# EAGLE design touch sensor3 (EAGLE 9.6.2)
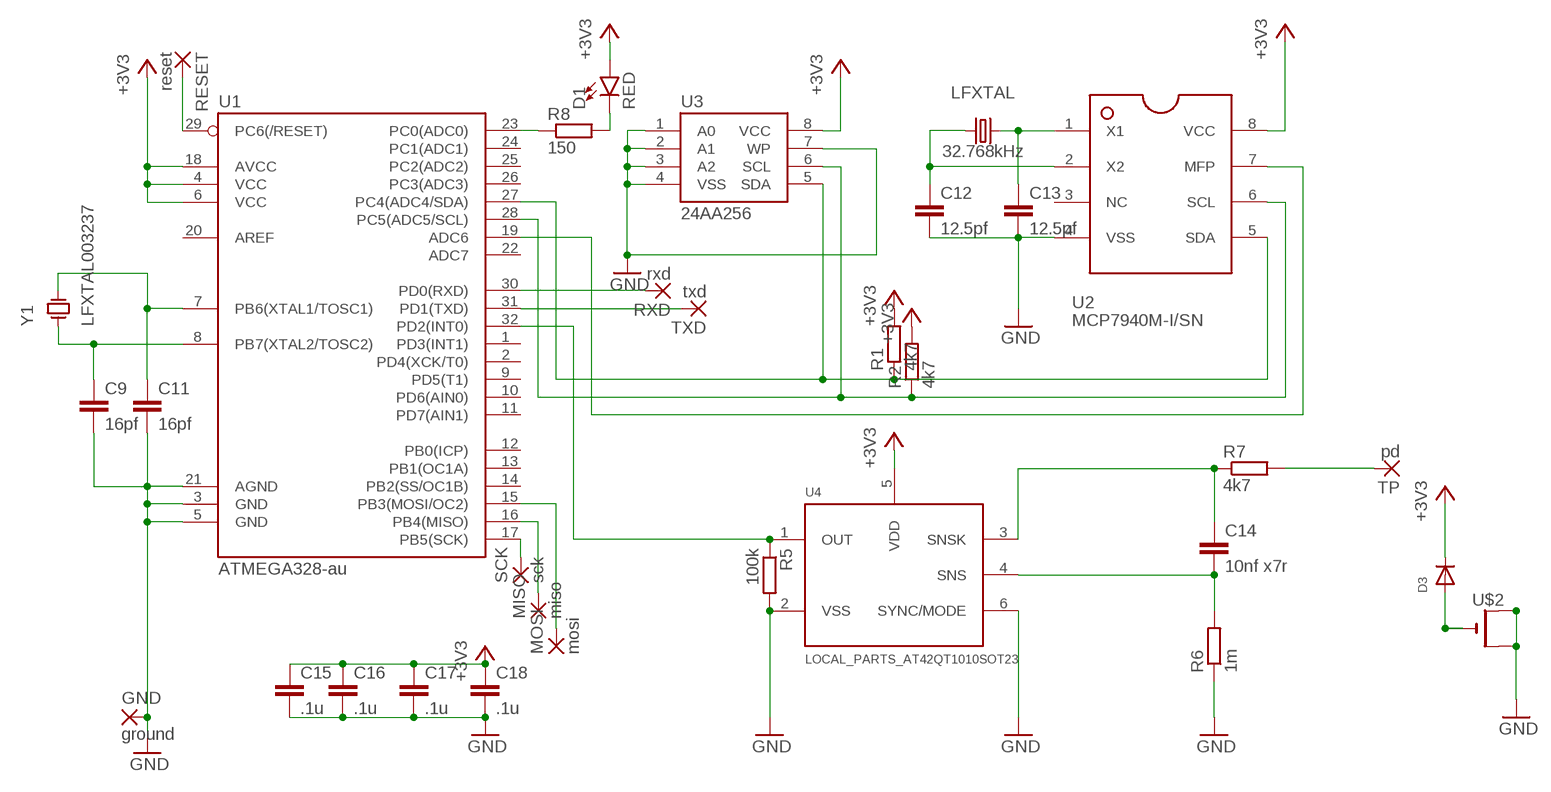
[diagram p0: schematic, sheet 1]

## Parts
C9  16pf  C-EUC0805  [C0805]
C11  16pf  C-EUC0805  [C0805]
C12  12.5pf  C-EUC0805  [C0805]
C13  12.5pf  C-EUC0805  [C0805]
C14  10nf x7r  C-EUC0805  [C0805]
C15  .1u  C-EUC0805  [C0805]
C16  .1u  C-EUC0805  [C0805]
C17  .1u  C-EUC0805  [C0805]
C18  .1u  C-EUC0805  [C0805]
D1  RED  LED-RED0603  [LED-0603]
D3  DIODESMA  [SMADIODE]
GND  ground  WIREPADSMD1,27-254  [SMD1,27-2,54]
LFXTAL  32.768kHz  CRYSTAL-32.768KHZPTH-2X6  [CRYSTAL-PTH-2X6-CYL]
MISO  miso  WIREPADSMD1,27-254  [SMD1,27-2,54]
MOSI  mosi  WIREPADSMD1,27-254  [SMD1,27-2,54]
R1  4k7  R-EU_M0805  [M0805]
R2  4k7  R-EU_M0805  [M0805]
R5  100k  R-EU_R0805  [R0805]
R6  1m  R-EU_R0805  [R0805]
R7  4k7  R-EU_R0805  [R0805]
R8  150  R-EU_R0805  [R0805]
RESET  reset  WIREPADSMD1,27-254  [SMD1,27-2,54]
RXD  rxd  WIREPADSMD1,27-254  [SMD1,27-2,54]
SCK  sck  WIREPADSMD1,27-254  [SMD1,27-2,54]
TP  pd  WIREPADSMD1,27-254  [SMD1,27-2,54]
TXD  txd  WIREPADSMD1,27-254  [SMD1,27-2,54]
U1  ATMEGA328-au  ATMEGA328P_TQFP  [TQFP32-08]
U2  MCP7940M-I/SN  [SO08]
U3  24AA256  EEPROM-I2CSMD  [SO08]
U4  LOCAL_PARTS_AT42QT1010SOT23  [LOCAL_PARTS_SOT23-6]
U$2  CR2032SMT  [CR2032-SMD]
Y1  LFXTAL003237  [XTAL1140X490X430N]

## Nets
+3V3: C15.1 C16.1 C17.1 C18.1 D1.A D3.C R1.2 R2.2 U1.4(VCC) U1.6(VCC) U1.18(AVCC) U2.8(VCC) U3.8(VCC) U4.5(VDD)
GND: C9.2 C11.2 C12.2 C13.2 C15.2 C16.2 C17.2 C18.2 GND.1(P) R5.2 R6.1 U1.3(GND) U1.5(GND) U1.21(AGND) U2.4(VSS) U3.1(A0) U3.2(A1) U3.3(A2) U3.4(VSS) U3.7(WP) U4.2(VSS) U4.6(SYNC/MODE) U$2.+$1(+) U$2.+$2(+1)
N$1: C13.1 LFXTAL.2 U2.1(X1)
N$2: C12.1 LFXTAL.1 U2.2(X2)
N$3: R1.1 U1.27(PC4(ADC4/SDA)) U2.5(SDA) U3.5(SDA)
N$4: R2.1 U1.28(PC5(ADC5/SCL)) U2.6(SCL) U3.6(SCL)
N$5: C11.1 U1.7(PB6(XTAL1/TOSC1)) Y1.2
N$6: R5.1 U1.32(PD2(INT0)) U4.1(OUT)
N$7: C9.1 U1.8(PB7(XTAL2/TOSC2)) Y1.1
N$8: R8.1 U1.23(PC0(ADC0))
N$9: D1.C R8.2
N$10: C14.2 R6.2 U4.4(SNS)
N$11: C14.1 R7.1 U4.3(SNSK)
N$12: R7.2 TP.1(P)
N$13: RESET.1(P) U1.29(PC6(/RESET))
N$14: U1.19(ADC6) U2.7(MFP)
N$16: RXD.1(P) U1.30(PD0(RXD))
N$17: TXD.1(P) U1.31(PD1(TXD))
N$18: SCK.1(P) U1.17(PB5(SCK))
N$19: MISO.1(P) U1.16(PB4(MISO))
N$20: MOSI.1(P) U1.15(PB3(MOSI/OC2))
VBAT: D3.A U$2.-
Unconnected: U1.1(PD3(INT1)) U1.2(PD4(XCK/T0)) U1.9(PD5(T1)) U1.10(PD6(AIN0)) U1.11(PD7(AIN1)) U1.12(PB0(ICP)) U1.13(PB1(OC1A)) U1.14(PB2(SS/OC1B)) U1.20(AREF) U1.22(ADC7) U1.24(PC1(ADC1)) U1.25(PC2(ADC2)) U1.26(PC3(ADC3)) U2.3(NC)

## Library data of the parts
C9 C11-C18 = rcl:C-EU: CAPACITOR, European symbol; SPICEPREFIX: C
D1 = SparkFun-LED:LED-RED: Red SMD LED Used in manufacturing of most products at SparkFun Packages: 0603 - SMD 0603 package [Product Link] <http://docs.avagotech.com/docs/AV02-0551EN> 0603 SMART - SMD 0603 SMART package ( more efficient and expensive)[Product Link] <http://www.osram-os.com/Graphics/XPic2/00077099_0.pdf> 1206 - SMD1206 package [Product Link] <https://www.sparkfun.com/datasheets/DevTools/LilyPad/Q150OVS4.pdff> SparkFun Products: Pro Mini 328 -5V <https://www.sparkfun.com/products/821> RedBoard <https://www.sparkfun.com/products/12757> IOIO-OTG <https://www.sparkfun.com/products/13613>; PROD_ID: DIO-00819
D3 = adafruit:DIODE: Diode SMADIODE - SMA Surface Mount Package 20V 1A Schottky Diode Digikey: 641-1014-6-ND DO-1N4148 - Through Hole Small Current Diode SOD-123 20V 1 A (.5mV Vf) Schottky Diode - Digikey: MBRX120TPMSCT-ND SOD-323 10V 570mA (.38mV Vf, 3ns) Schottky Diode - Digikey: ZLLS410CT-ND SOD-523 30V 30mA Schottky Diode (RB751S-40TE61) - Digikey: RB751S-40TE61CT-ND SOT23-R/W - SOT23 Package (R = Solder Paste/Reflow Ovens, W = Hand-Soldering) BAT54Film 40V 300mA - Digikey: 497-7162-1-ND
GND MISO MOSI RESET RXD SCK TP TXD = wirepad:WIREPAD: Wire PAD connect wire on PCB
LFXTAL = SparkFun-Clocks:CRYSTAL-32.768KHZ: 32.768kHz Crystal Frequency: 32.768kHz Frequency Stability: ±20ppm Load Capacitance: 12.5pF (PTH-2X6 & SMD-3.2X1.5), 6pF (SMD-2X6) SparkFun Products: SparkFun BigTime Watch Kit <https://www.sparkfun.com/products/11734> SparkFun nRF52832 Breakout <https://www.sparkfun.com/products/13990> SparkFun Real Time Clock Module <https://www.sparkfun.com/products/12708>; PROD_ID: XTAL-10112
R1 R2 R5-R8 = rcl:R-EU_: RESISTOR, European symbol; SPICEPREFIX: R
U1 = SparkFun-IC-Microcontroller:ATMEGA328P_TQFP: Popular 328P in QFP Storefront component: ATmega328 - TQFP <https://www.sparkfun.com/products/13448> (COM-13448) Datasheet <http://www.sparkfun.com/datasheets/Components/SMD/ATMega328.pdf> SparkFun Products SparkFun RedBoard - Programmed with Arduino <https://www.sparkfun.com/products/12757> (DEV-12757) Arduino Pro Mini 328 - 5V/16MHz <https://www.sparkfun.com/products/11113> (DEV-11113) Arduino Pro Mini 328 - 3.3V/8MHz <https://www.sparkfun.com/products/11114> (DEV-11114) SparkFun OpenLog <https://www.sparkfun.com/products/13712> (DEV-13712) SparkFun MicroView - OLED Arduino Module <https://www.sparkfun.com/products/12923> (DEV-12923) SparkFun Digital Sandbox <https://www.sparkfun.com/products/12651> (DEV-12651) SparkFun PicoBoard <https://www.sparkfun.com/products/11888> (WIG-11888) Arduino Fio <https://www.sparkfun.com/products/10116> (DEV-10116) LilyPad Arduino 328 Main Board <https://www.sparkfun.com/products/13342> (DEV-13342) SparkFun RedStick <https://www.sparkfun.com/products/13741> (DEV-13741) LilyPad MP3 <https://www.sparkfun.com/products/11013> (DEV-11013) LilyPad Arduino SimpleSnap <https://www.sparkfun.com/products/10941> (DEV-10941) SparkFun Stepoko <https://www.sparkfun.com/products/13899> (ROB-13899) SparkFun Geiger Counter <https://www.sparkfun.com/products/11345> (SEN-11345) SparkFun EL Sequencer <https://www.sparkfun.com/products/12781> (COM-12781) Arduino Pro 328 - 5V/16MHz <https://www.sparkfun.com/products/10915> (DEV-10915) CryptoCape <https://www.sparkfun.com/products/12773> (DEV-12773) SparkFun IR Thermometer Evaluation Board - MLX90614 <https://www.sparkfun.com/products/10740> (SEN-10740) SparkFun RedBot Mainboard <https://www.sparkfun.com/products/12097> (ROB-12097) Arduino Pro 328 - 3.3V/8MHz <https://www.sparkfun.com/products/10914> (DEV-10914) SparkFun Block for Intel® Edison - Arduino <https://www.sparkfun.com/products/13036> (DEV-13036) SparkFun Simon Says - Surface Mount Soldering Kit <https://www.sparkfun.com/products/10935> (KIT-10935) SparkFun 7-Segment Serial Display - Red <https://www.sparkfun.com/products/11441> (COM-11441) SparkFun 7-Segment Serial Display - White <https://www.sparkfun.com/products/11629> (COM-11629) SparkFun 7-Segment Serial Display - Yellow <https://www.sparkfun.com/products/11443> (COM-11443) SparkFun 7-Segment Serial Display - Kelly Green <https://www.sparkfun.com/products/11440> (COM-11440) SparkFun 7-Segment Serial Display - Blue <https://www.sparkfun.com/products/11442> (COM-11442) SparkFun OpenSegment Serial Display - 20mm (Blue) <https://www.sparkfun.com/products/11647> (COM-11647) SparkFun OpenSegment Serial Display - 20mm (Green) <https://www.sparkfun.com/products/11646> (COM-11646) SparkFun OpenSegment Serial Display - 20mm (White) <https://www.sparkfun.com/products/11648> (COM-11648) SparkFun OpenSegment Serial Display - 20mm (Red) <https://www.sparkfun.com/products/11644> (COM-11644) SparkFun OpenSegment Serial Display - 20mm (Yellow) <https://www.sparkfun.com/products/11645> (COM-11645) SparkFun OpenSegment Shield <https://www.sparkfun.com/products/13190> (DEV-13190); PROD_ID: IC-09069; VALUE: ATMEGA328P_TQFP
U2 = MCP7940M-I_SN:MCP7940M-I/SN: http://octopart.com/mcp7940m-i%2Fsn-microchip-21636090; AVAILABILITY: Unavailable; DESCRIPTION: Real Time Clock (RTC) IC Clock/Calendar 64B I²C, 2-Wire Serial 8-SOIC (0.154, 3.90mm Width); MF: Microchip; MP: MCP7940M-I/SN; PACKAGE: SOIC-8 Microchip; PRICE: None
U3 = SparkFun-IC-Memory:EEPROM-I2C: I2C EEPROMs, 24LC256 and others 24LC256 Series 256 kb I2C 2 Wire (32 k x 8 Bit) 2.5 V Serial EEPROM SMD - SOIC-8 Datasheet SparkFun Products SparkFun UDB5 - PIC UAV Development Board <https://www.sparkfun.com/products/11703> (GPS-11703); PROD_ID: IC-09714; VALUE: 24LC256
U4 = AT42QT101X_Capacitive_Touch_Breakout7:LOCAL_PARTS_AT42QT1010: Atmel AT42QT1010 The AT42QT1010 (QT1010) is a digital burst mode charge-transfer (QT™) sensor that is capable of detecting nearproximityor touch, making it ideal for implementing touch controls.The QT1010 is designed specifically for human interfaces, like control panels, appliances, toys, lighting controls, or anywhere a mechanical switch or button may be found. It includes all hardware and signal processing functions necessary to provide stable sensing under a wide variety of changing conditions. Only a single low-cost capacitor is required for operation. This chip is identical to the AT42QT1011, however the capsense times out after 60 seconds. Reciprocally, the capsense on the 1011 never times out. Reference "Signal Processing" in the datasheet. Datasheet <http://www.atmel.com/images/Atmel-9541-AT42-QTouch-BSW-AT42QT1010_Datasheet.pdf> Sparkfun Products Sparkfun Capacitive Touch Breakout <https://www.sparkfun.com/products/12041> (SEN-12041)
U$2 = adafruit:CR2032
Y1 = LFXTAL003237:LFXTAL003237: HC49/4HSMX Series 16.000 MHz ±30 ppm 16 pF Low Profile Surface Mount Crystal; AVAILABILITY: Unavailable; DESCRIPTION: 16MHz ±30ppm Crystal 16pF 40 Ohms HC-49/US; MF: IQD Frequency Products; MP: LFXTAL003237; PACKAGE: HC-49/US IQD Frequency Products; PRICE: None

## Board
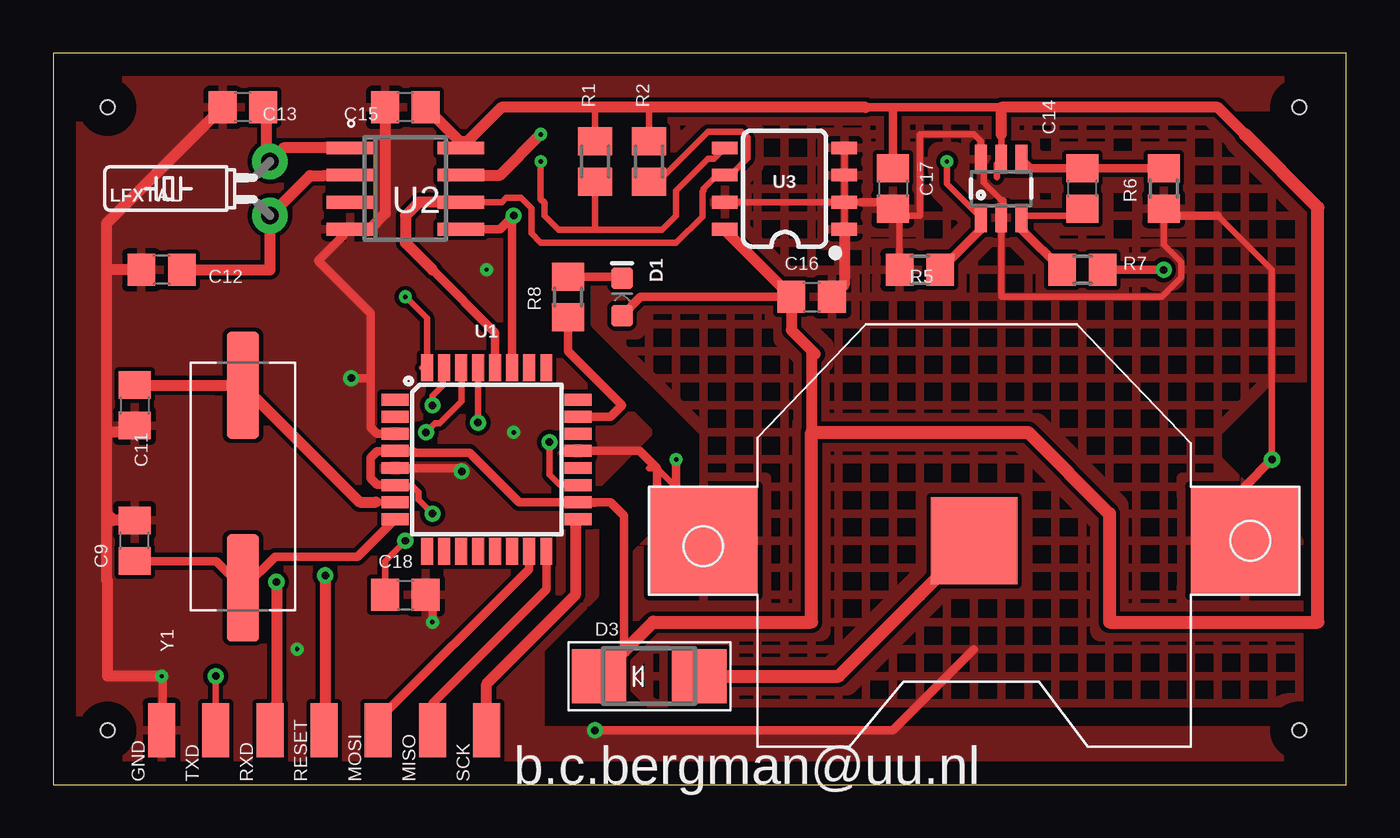
[diagram p1: board, top side]
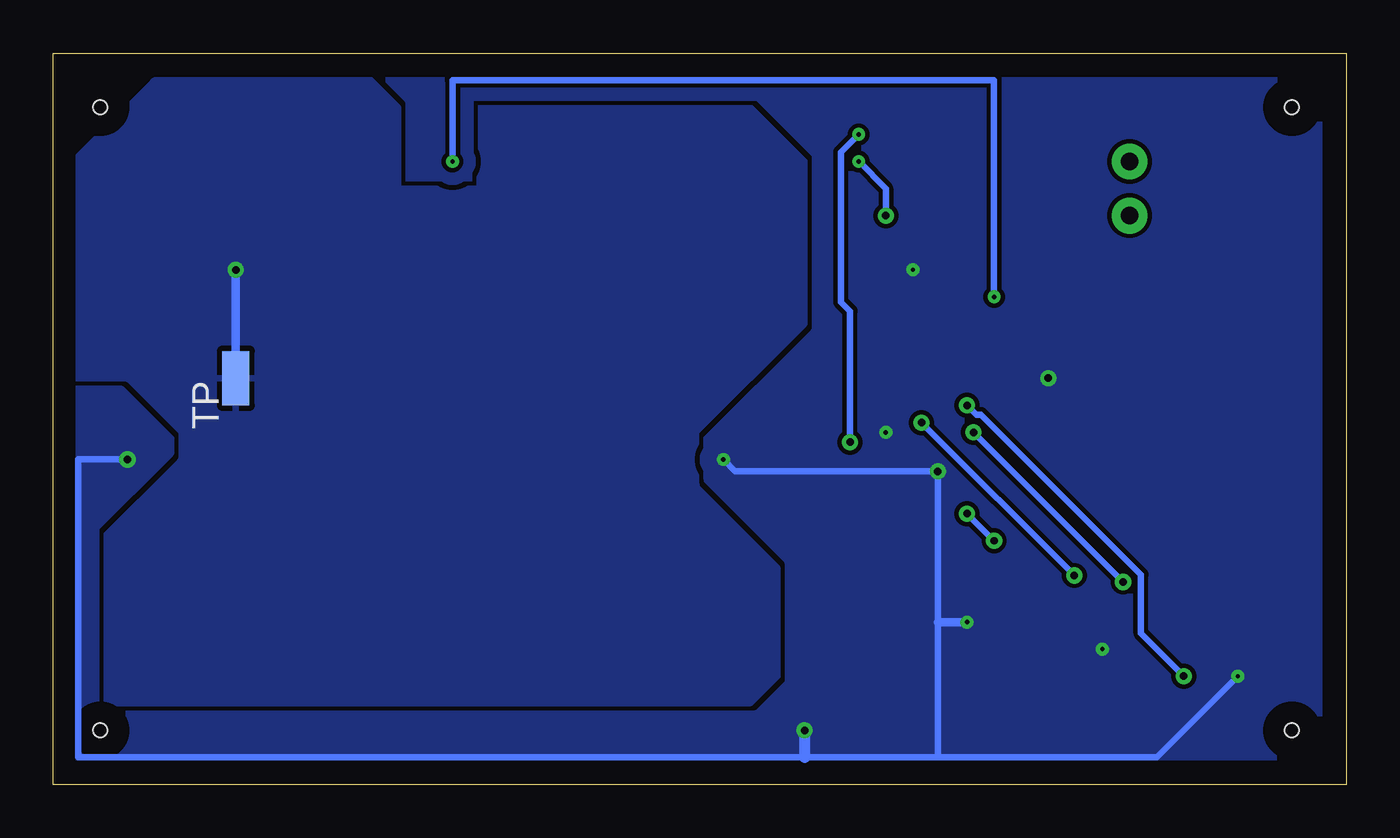
[diagram p2: board, bottom side, seen from below]

Size 60.63 x 34.28 mm. Coordinates in mm from the lower left corner, seen from the top.
Outline: 0,0 60.63,0 60.63,34.28 0,34.28 0,0
Copper layers (1*16): Top 0.035mm / dielectric 1.5mm / Bottom 0.035mm
Design rules "default *": minimum track width 12mil, minimum drill 0.2mm, track to track 8mil, track to pad 8mil, pad to pad 8mil, via to via 8mil, smd to smd 8mil, copper to edge 40mil, drill to drill 6mil, minimum pad ring 10mil, minimum via ring 8mil, stop-mask expansion 4mil, vias tented up to drill 0mil, thermal gap 10mil
Holes 0.65 mm at 2.54,31.75 2.54,2.54 58.42,2.54 58.42,31.75

### Footprints (pad centres in the part's own frame; a part is rotated, then mirrored left to right if it is on the bottom)
C0805 = smd 1.3 x 1.5: 1 -0.95,0; 2 0.95,0
LED-0603 = smd 1 x 1: A -0.877,0; C 0.877,0
SMADIODE = smd 2.54 x 2.54: A 2.349,0; C -2.349,0
SMD1,27-2,54 = smd 1.27 x 2.54: 1 0,0
CRYSTAL-PTH-2X6-CYL = drill 0.813 pad 1.676: 1 -1.27,0; 2 1.27,0
M0805 = smd 1.3 x 1.6: 1 -0.95,0; 2 0.95,0
R0805 = smd 1.3 x 1.5: 1 -0.95,0; 2 0.95,0
TQFP32-08 = smd 1.27 x 0.559: 1 -4.293,2.8; 2 -4.293,2; 3 -4.293,1.2; 4 -4.293,0.4; 5 -4.293,-0.4; 6 -4.293,-1.2; 7 -4.293,-2; 8 -4.293,-2.8; 17 4.293,-2.8; 18 4.293,-2; 19 4.293,-1.2; 20 4.293,-0.4; 21 4.293,0.4; 22 4.293,1.2; 23 4.293,2; 24 4.293,2.8 | smd 0.559 x 1.27: 9 -2.8,-4.293; 10 -2,-4.293; 11 -1.2,-4.293; 12 -0.4,-4.293; 13 0.4,-4.293; 14 1.2,-4.293; 15 2,-4.293; 16 2.8,-4.293; 25 2.8,4.293; 26 2,4.293; 27 1.2,4.293; 28 0.4,4.293; 29 -0.4,4.293; 30 -1.2,4.293; 31 -2,4.293; 32 -2.8,4.293
SO08 = smd 2.2 x 0.6: 1 -2.6,1.905; 2 -2.6,0.635; 3 -2.6,-0.635; 4 -2.6,-1.905; 5 2.6,-1.905; 6 2.6,-0.635; 7 2.6,0.635; 8 2.6,1.905
SO08' = smd 0.6 x 1.2: 1 -1.905,-2.8; 2 -0.635,-2.8; 3 0.635,-2.8; 4 1.905,-2.8; 5 1.905,2.8; 6 0.635,2.8; 7 -0.635,2.8; 8 -1.905,2.8
LOCAL_PARTS_SOT23-6 = smd 0.55 x 1.35: 1 -0.95,-1.375; 2 0,-1.375; 3 0.95,-1.375; 4 0.95,1.375; 5 0,1.375; 6 -0.95,1.375
CR2032-SMD = smd 5.08 x 5.08: +$1 -12.7,0; +$2 12.7,0 | smd 4.064 x 4.064: - 0,0
XTAL1140X490X430N = smd 5.01 x 1.51: 1 -4.75,0; 2 4.75,0

### Placement (x,y rotation side)
C9  3.81,11.43 90 top
C11  3.81,17.78 270 top
C12  5.08,24.13 180 top
C13  8.89,31.75 180 top
C14  48.26,27.94 90 top
C15  16.51,31.75 180 top
C16  35.56,22.86 0 top
C17  39.37,27.94 270 top
C18  16.51,8.89 0 top
D1  26.67,22.86 90 top
D3  27.94,5.08 0 top
GND  5.08,2.54 0 top
LFXTAL  10.16,27.94 90 top
MISO  17.78,2.54 0 top
MOSI  15.24,2.54 0 top
R1  25.4,29.21 90 top
R2  27.94,29.21 90 top
R5  40.64,24.13 180 top
R6  52.07,27.94 90 top
R7  48.26,24.13 0 top
R8  24.13,22.86 90 top
RESET  12.7,2.54 0 top
RXD  10.16,2.54 0 top
SCK  20.32,2.54 0 top
TP  52.07,19.05 0 bottom
TXD  7.62,2.54 0 top
U1  20.32,15.24 0 top
U2  16.51,27.94 0 top
U3  24AA256  [SO08']  34.29,27.94 90 top
U4  44.45,27.94 0 top
U$2  43.18,11.43 180 top
Y1  8.89,13.97 90 top

### Tracks (layer width: path | path; a pad name or v marks a point on that pad's centre or on a via)
+3V3  (via drill 0.35)
  Top 0.305: 19,29.92 U2.8 | 25.4,13.18 24.68,13.18 U1.18 | 44.25,28.46 44.25,29.11 U4.5 44.45,30.48 | 19.4,30.13 U2.8 | 19.15,29.8 U2.8 | 19.11,30 U2.8 | 15.4,9.05 15.24,9.21 | 15.96,14.1 U1.6 16.09,13.98 16.85,13.98 17.12,13.71 17.12,13.36 v17.78,12.7 | R1.2 25.4,31.75 | R2.2 27.94,31.75 | C18.1 15.56,10.48 v16.51,11.43
  Top 0.406: 26.77,6.25 26.77,12.61 26.13,13.24 U1.18 21.85,13.24 19.52,15.57 16.93,15.57 16.87,15.63 16.02,15.63 | 44.45,31.75 39.37,31.75 | 39.37,31.75 38.1,31.75 | C17.1 39.37,31.75 | C16.1 27.55,22.86 D1.A | U1.6 16.02,14.05 15.18,14.05 14.88,14.35 14.88,15.33 15.18,15.63 16.02,15.63 | 16.02,15.63 U1.4 | C18.1 15.4,9.05
  Top 0.508: 55.88,30.48 54.61,31.75 44.45,31.75 44.45,30.48 | 38.1,31.75 27.94,31.75 25.4,31.75 21.02,31.75 19.4,30.13 18.98,30.13 | C15.1 19.15,30.06 19.15,29.8 | U3.8 31.49,25.98 C16.1 34.61,21.3 35.56,20.35 | 35.56,20.35 35.56,16.51 | 35.73,20.18 35.56,20.35
  Top 0.61: D3.C 26.77,6.25 28.13,7.62 35.56,7.62 35.56,16.51 45.72,16.51 49.53,12.7 49.53,7.62 59.31,7.62 59.31,27.05 55.88,30.48
  Bottom 0.305: v16.51,11.43 v17.78,12.7
GND  (via drill 0.2, 0.35)
  Top 0.305: 24.49,15.6 U1.21 | 44.55,26.47 U4.2 | U4.6 43.64,29.36 43.64,29.82 U4.6 | 5.13,2.64 GND.1 5.13,2.79 | 44.55,27.38 44.55,27.3 | U4.2 44.55,26.62 44.55,27.3 | 30.43,13.46 30.43,12.7 | 30.43,12.7 30.43,11.48 U$2.+$2 29.21,12.7 29.21,13.97 | 55.88,13.92 U$2.+$1 57.15,12.7 | 13.62,25.75 U2.4 13.97,25.96 14.61,25.96 | U3.7 U3.2 | U3.2 U3.3 U3.4 | U3.2 U3.1 | U3.2 37.88,27.3 | 27.94,14.82 28.31,14.82 30.43,12.7 | U4.6 43.64,29.18 43.64,28.21 44.55,27.3 | R5.2 39.69,26.67 40.64,26.67 40.64,30.48 43.18,30.48 43.5,30.16 U4.6 | R6.1 52.07,25.31 52.9,24.48 52.9,23.78 51.98,22.86 44.45,22.86 U4.2 | 54.61,26.67 57.15,24.13 v57.15,15.24
  Top 0.406: v29.21,15.24 29.21,13.97 | U$2.+$2 28.31,13.6 28.31,14.82 27.49,15.64 U1.21 | 5.13,2.79 5.13,5.03 v5.08,5.08 | 3.49,12.7 C9.2 | 13.62,25.75 12.42,24.55 14.88,22.09 14.88,19.05 | 14.88,19.05 14.88,16.75 15.2,16.44 U1.3 | C18.2 17.78,8.57 v17.78,7.62 | 37.88,27.3 39.05,27.3 C17.2 39.69,26.67 | R6.1 52.39,26.67 54.61,26.67 | U$2.+$1 55.88,13.97 v57.15,15.24 | U1.5 18.99,14.84 v19.15,14.68 | 14.88,19.05 v13.97,19.05 | v25.4,2.54 39.37,2.54 43.18,6.35
  Top 0.508: v5.08,5.08 2.54,5.08 2.54,9.56 2.5,9.6 2.5,12.7 | 2.5,12.7 2.5,16.51 | 2.5,16.51 2.5,24.13 | 2.5,24.13 2.5,26.31 C13.2 | C11.2 3.49,16.51 2.5,16.51 | C9.2 2.82,12.38 2.5,12.7 | C12.2 2.5,24.13 | C15.2 15.56,30.38 15.57,30.38 15.57,26.77 14.75,25.96 14.61,25.96 | U3.1 37.09,23.44 C16.2
  Bottom 0.305: v5.08,5.08 8.89,1.27 19.05,1.27 | 19.05,1.27 25.4,1.27 59.46,1.27 59.46,15.24 v57.15,15.24 | 19.05,1.27 19.15,1.37 19.15,7.62 v19.15,14.68 21.59,14.68 28.65,14.68 v29.21,15.24
  Bottom 0.406: 19.15,7.62 v17.78,7.62
  Bottom 0.508: v25.4,2.54 25.4,1.27
  other vias: 11.43,6.35 20.32,24.13 21.59,16.51
  pour Bottom (rank 2): 1.27,33.02 1.27,2.65 arc45 1.34,2.47 2.54,1.27 59.69,1.27 59.69,33.02
  pour Top (rank 2): 1.27,2.65 arc45 1.34,2.47 2.54,1.27
  pour Top (hatched): 25.4,21.59 30.48,16.51 30.48,13.97 26.67,10.16 26.67,5.08 27.94,3.81 58.42,3.81 58.42,11.43 54.61,15.24 54.61,16.51 57.15,19.05 59.69,19.05 59.69,33.02 29.21,33.02 26.67,30.48 25.4,29.21 25.4,27.94
  pour Top: 25.4,33.02 2.54,33.02 1.27,31.75 1.27,2.54 2.54,1.27 59.69,1.27 59.69,2.54 22.86,2.54 22.86,6.35 25.4,8.89 25.4,13.97 27.94,16.51 22.86,21.59 22.86,29.21 25.4,31.75 58.42,31.75 58.42,33.02
N$1
  Top 0.305: 13.82,29.92 U2.1
  Top 0.406: 10.79,29.84 LFXTAL.2 | 10,31.59 C13.1
  Top 0.508: U2.1 10.79,29.84 | LFXTAL.2 10,29.37 10,31.59
N$2
  Top 0.305: 13.82,28.55 U2.2
  Top 0.406: 12.7,28.55 13.82,28.55
  Top 0.508: C12.1 10.16,24.13 LFXTAL.1 12.04,28.55 12.7,28.55
N$3  (via drill 0.2, 0.35)
  Top 0.305: 18.24,26.11 19,26.11 U2.5 | U3.5 30.98,29.33 30.7,29.33 29.21,27.84 29.21,26.67 28.55,26.01 25.4,26.01 | v22.86,29.21 22.86,27.44 23.03,27.27 23.03,26.67 23.7,26.01 25.4,26.01 | R1.1 25.4,26.01
  Top 0.406: U1.27 21.52,26.6 | 21.52,26.6 v21.59,26.67 | U2.5 20.95,26.04 21.52,26.6
  Bottom 0.305: v22.86,29.21 21.59,27.94 v21.59,26.67
N$4
  Top 0.305: U1.28 20.68,19.56 20.66,19.58 | U2.6 21.04,27.3 21.24,27.51 21.94,27.51 22.42,27.02 22.42,25.84 22.86,25.4 29.21,25.4 30.43,26.62 30.43,27.79 30.48,27.84 30.48,27.94 31.12,28.57 U3.6 31.77,28.57 32.55,29.36 32.55,30.33 32.28,30.6 30.7,30.6 28.36,28.26 R2.1
  Top 0.406: 17.78,24.13 20.72,21.19 U1.28
  Top 0.508: 17.78,24.13 16.51,25.4 16.51,26.67 17.15,27.3 U2.6
N$5
  Top 0.305: U1.7 15.12,13.24 | Y1.2 8.94,18.67 8.94,18.59 8.89,18.59 7.67,18.59 7.62,18.64
  Top 0.406: 8.75,18.73 8.89,18.59
  Top 0.508: C11.1 8.75,18.73 | Y1.2 14.37,13.24 15.12,13.24
N$6  (via drill 0.2)
  Top 0.305: 17.48,19.56 U1.32 | 17.32,19.56 U1.32 | U1.32 17.3,19.53 | v16.51,22.86 17.52,21.85 U1.32 | U4.1 41.91,28.16 v41.91,29.21
  Top 0.406: R5.1 43.5,26.04 U4.1
  Bottom 0.305: v16.51,22.86 16.51,33.02 41.91,33.02 v41.91,29.21
N$7
  Top 0.305: 15.95,12.39 U1.8
  Top 0.406: C9.1 7.63,10.48 Y1.1 8.93,9.22 10.4,10.69 14.28,10.69 U1.8
N$8
  Top 0.305: 26.16,17.27 24.64,17.27 U1.23
  Top 0.406: U1.23 26.13,17.24 26.67,17.78 24.13,20.32 R8.1
N$9
  Top 0.406: R8.2 26.6,23.81 D1.C
N$10
  Top 0.305: 45.47,29.21 U4.4
  Top 0.406: R6.2 C14.2 45.79,28.89 45.47,29.21
N$11
  Top 0.305: U4.3 45.51,26.67 47.94,26.67 C14.1
  Top 0.406: R7.1 45.4,26.04 U4.3
N$12  (via drill 0.35)
  Top 0.406: R7.2 v52.07,24.13
  Bottom 0.406: TP.1 v52.07,24.13
  pour Bottom (isolate 1.016): 40.64,31.75 28.05,31.75 arc45 27.87,31.68 25.4,29.21 25.4,21.7 arc45 25.47,21.52 30.48,16.51 30.48,14.08 arc-45 30.41,13.9 27.94,11.43 26.74,10.23 arc45 26.67,10.05 26.67,5.08 27.87,3.88 arc45 28.05,3.81 58.42,3.81 58.42,11.43 54.68,15.17 arc-45 54.61,15.35 54.61,16.51 57.08,18.98 arc-45 57.26,19.05 59.69,19.05 59.69,29.21 55.95,32.95 arc45 55.77,33.02 45.72,33.02 44.52,31.82 arc45 44.45,31.64 44.45,27.94 40.64,27.94
N$13  (via drill 0.35)
  Top 0.305: U1.29 19.91,19.41 v19.91,16.97 | 12.75,2.64 RESET.1 12.75,2.79 12.75,3.81
  Top 0.508: v12.75,9.8 12.75,3.81
  Bottom 0.305: v12.75,9.8 v19.91,16.97
N$14  (via drill 0.2, 0.35)
  Top 0.305: 24.64,14.07 U1.19 24.49,14.07 23.72,14.07 23.27,14.53 v23.27,16.05
  Top 0.508: U2.7 20.95,28.57 v22.86,30.48
  Bottom 0.305: v23.27,16.05 23.27,22.19 23.7,22.62 23.7,29.65 v22.86,30.48
N$16  (via drill 0.35)
  Top 0.305: 19.15,19.56 U1.30 19.15,19.41 19.15,17.97 18.13,16.95 17.91,16.95 v17.48,16.51 | 10.46,3.81 10.46,2.95 10.16,2.64 RXD.1
  Top 0.508: v10.46,9.5 10.46,3.81
  Bottom 0.305: v10.46,9.5 v17.48,16.51
N$17  (via drill 0.35)
  Top 0.305: TXD.1 v7.62,5.08 | U1.31 18.26,19.47 18.26,18.71 17.78,18.23 v17.78,17.78
  Bottom 0.305: v17.78,17.78 17.34,17.35 17.13,17.35 9.63,9.85 9.63,7.09 v7.62,5.08
N$18
  Top 0.305: 24.49,8.89 24.49,12.39 U1.17
  Top 0.508: SCK.1 20.32,4.72 24.49,8.89 24.49,12.31 U1.17
N$19
  Top 0.305: 23.11,10.87 U1.16
  Top 0.406: U1.16 23.12,9.15 17.78,3.81 MISO.1
N$20
  Top 0.305: 22.35,10.87 U1.15
  Top 0.406: U1.15 22.31,10.93 22.31,10.1 15.24,3.04 15.24,2.96
  Top 0.508: 15.24,2.96 MOSI.1
VBAT
  Top 0.61: D3.A 36.83,5.08 40.64,8.89 41.91,10.16 U$2.-

### Text on the board
tPlace: b.c.bergman@uu.nl